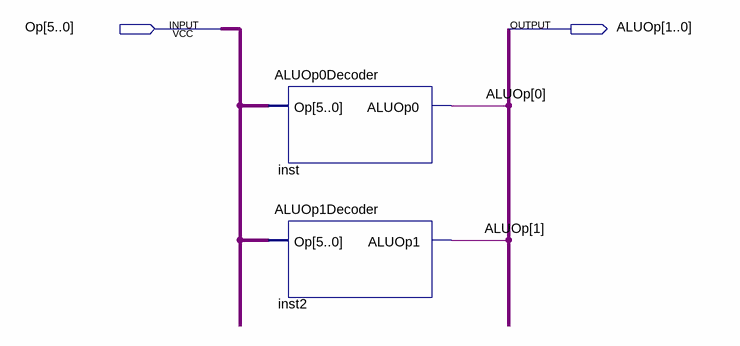
[diagram p0: schematic sheet]
// Quartus schematic ALUOpDecoder.bdf as structural Verilog: 2 symbols, 2 pins
module ALUOpDecoder (
  input  [5:0] Op,
  output [1:0] ALUOp
);

  ALUOp0Decoder inst (.Op(Op), .ALUOp0(ALUOp[0]));
  ALUOp1Decoder inst2 (.Op(Op), .ALUOp1(ALUOp[1]));
endmodule
